# Altium schematic sheet Sheet1.SchDoc
size A4
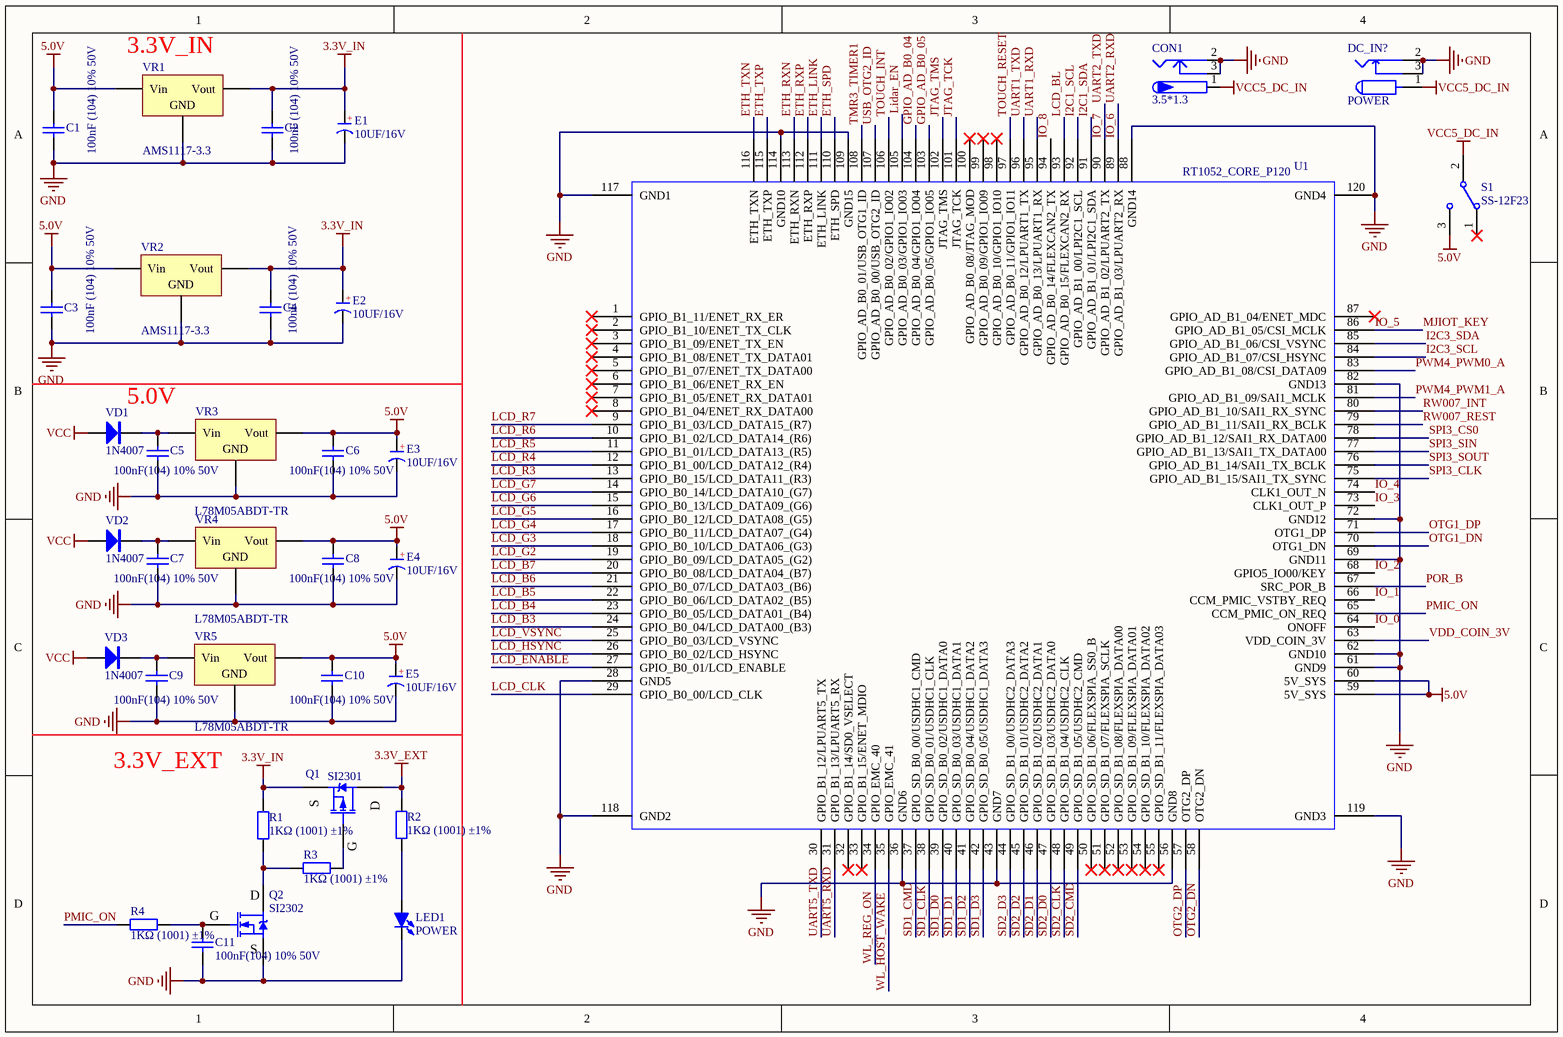
[diagram p0: Sheet1.SchDoc]

## Parts
C1  100nF (104) 10% 50V  [0603_C]
C2  100nF (104) 10% 50V  [0603_C]
C3  100nF (104) 10% 50V  [0603_C]
C4  100nF (104) 10% 50V  [0603_C]
C5  100nF(104) 10% 50V  [0805_C]
C6  100nF(104) 10% 50V  [0805_C]
C7  100nF(104) 10% 50V  [0805_C]
C8  100nF(104) 10% 50V  [0805_C]
C9  100nF(104) 10% 50V  [0805_C]
C10  100nF(104) 10% 50V  [0805_C]
C11  100nF(104) 10% 50V  [0805_C]
CON1  3.5*1.3  [DC-005]
DC_IN?  POWER  [DC10B]
E1  10UF/16V  [CAP 1.5*4*8]
E2  10UF/16V  [CAP 1.5*4*8]
E3  10UF/16V  [CAP 1.5*4*8 - GD]
E4  10UF/16V  [CAP 1.5*4*8 - GD]
E5  10UF/16V  [CAP 1.5*4*8 - GD]
LED1  POWER  [LED 3MM-B]
Q1  SI2301  [SOT23-3N]
Q2  SI2302  [SOT23-3N]
R1  1KΩ (1001) ±1%  [0603_R]
R2  1KΩ (1001) ±1%  [0603_R]
R3  1KΩ (1001) ±1%  [0603_R]
R4  1KΩ (1001) ±1%  [0603_R]
S1  SS-12F23  [SS-12F23]
U1  RT1052_CORE_P120  [RT1052_CORE_P120]
VD1  1N4007  [DO-41]
VD2  1N4007  [DO-41]
VD3  1N4007  [DO-41]
VR1  AMS1117-3.3  [SOT-223]
VR2  AMS1117-3.3  [SOT-223]
VR3  L78M05ABDT-TR  [TO-252-2-180]
VR4  L78M05ABDT-TR  [TO-252-2-180]
VR5  L78M05ABDT-TR  [TO-252-2-180]

## Nets
3.3V_EXT: Q1.3(D) R2.2
3.3V_IN: C2.2 C4.2 E1.1(A) E2.1(A) Q1.2(S) R1.2 VR1.2(Vout) VR2.2(Vout)
5.0V: C1.2 C3.2 C6.1 C8.1 C10.1 E3.1(A) E4.1(A) E5.1(A) S1.3 U1.59(5V_SYS) U1.60(5V_SYS) VR1.3(Vin) VR2.3(Vin) VR3.3(Vout) VR4.3(Vout) VR5.3(Vout)
GND: C1.1 C2.1 C3.1 C4.1 C5.2 C6.2 C7.2 C8.2 C9.2 C10.2 C11.2 CON1.2 CON1.3 DC_IN?.2 DC_IN?.3 E1.2(K) E2.2(K) E3.2(K) E4.2(K) E5.2(K) LED1.2(K) Q2.2(S) U1.28(GND5) U1.36(GND6) U1.43(GND7) U1.56(GND8) U1.61(GND9) U1.62(GND10) U1.69(GND11) U1.72(GND12) U1.82(GND13) U1.88(GND14) U1.109(GND15) U1.114(GND10) U1.117(GND1) U1.118(GND2) U1.119(GND3) U1.120(GND4) VR1.1(GND) VR2.1(GND) VR3.2(GND) VR4.2(GND) VR5.2(GND)
VCC: VD1.1(A) VD2.1(A) VD3.1(A)
VCC5_DC_IN: CON1.1 DC_IN?.1 S1.2
ETH_LINK: U1.111(ETH_LINK)
ETH_RXN: U1.113(ETH_RXN)
ETH_RXP: U1.112(ETH_RXP)
ETH_SPD: U1.110(ETH_SPD)
ETH_TXN: U1.116(ETH_TXN)
ETH_TXP: U1.115(ETH_TXP)
GPIO_AD_B0_04: U1.104(GPIO_AD_B0_04/GPIO1_IO04)
GPIO_AD_B0_05: U1.103(GPIO_AD_B0_05/GPIO1_IO05)
I2C1_SCL: U1.92(GPIO_AD_B1_00/LPI2C1_SCL)
I2C1_SDA: U1.91(GPIO_AD_B1_01/LPI2C1_SDA)
I2C3_SCL: U1.84(GPIO_AD_B1_07/CSI_HSYNC)
I2C3_SDA: U1.85(GPIO_AD_B1_06/CSI_VSYNC)
IO_0: U1.64(ONOFF)
IO_1: U1.66(CCM_PMIC_VSTBY_REQ)
IO_2: U1.68(GPIO5_IO00/KEY)
IO_3: U1.73(CLK1_OUT_P)
IO_4: U1.74(CLK1_OUT_N)
IO_5: U1.86(GPIO_AD_B1_05/CSI_MCLK)  [also labelled MJIOT_KEY]
IO_6: U1.89(GPIO_AD_B1_03/LPUART2_RX)  [also labelled UART2_RXD]
IO_7: U1.90(GPIO_AD_B1_02/LPUART2_TX)  [also labelled UART2_TXD]
IO_8: U1.94(GPIO_AD_B0_14/FLEXCAN2_TX)
JTAG_TCK: U1.101(JTAG_TCK)
JTAG_TMS: U1.102(JTAG_TMS)
LCD_B3: U1.24(GPIO_B0_04/LCD_DATA00_(B3))
LCD_B4: U1.23(GPIO_B0_05/LCD_DATA01_(B4))
LCD_B5: U1.22(GPIO_B0_06/LCD_DATA02_(B5))
LCD_B6: U1.21(GPIO_B0_07/LCD_DATA03_(B6))
LCD_B7: U1.20(GPIO_B0_08/LCD_DATA04_(B7))
LCD_BL: U1.93(GPIO_AD_B0_15/FLEXCAN2_RX)
LCD_CLK: U1.29(GPIO_B0_00/LCD_CLK)
LCD_ENABLE: U1.27(GPIO_B0_01/LCD_ENABLE)
LCD_G2: U1.19(GPIO_B0_09/LCD_DATA05_(G2))
LCD_G3: U1.18(GPIO_B0_10/LCD_DATA06_(G3))
LCD_G4: U1.17(GPIO_B0_11/LCD_DATA07_(G4))
LCD_G5: U1.16(GPIO_B0_12/LCD_DATA08_(G5))
LCD_G6: U1.15(GPIO_B0_13/LCD_DATA09_(G6))
LCD_G7: U1.14(GPIO_B0_14/LCD_DATA10_(G7))
LCD_HSYNC: U1.26(GPIO_B0_02/LCD_HSYNC)
LCD_R3: U1.13(GPIO_B0_15/LCD_DATA11_(R3))
LCD_R4: U1.12(GPIO_B1_00/LCD_DATA12_(R4))
LCD_R5: U1.11(GPIO_B1_01/LCD_DATA13_(R5))
LCD_R6: U1.10(GPIO_B1_02/LCD_DATA14_(R6))
LCD_R7: U1.9(GPIO_B1_03/LCD_DATA15_(R7))
LCD_VSYNC: U1.25(GPIO_B0_03/LCD_VSYNC)
Lidar_EN: U1.105(GPIO_AD_B0_03/GPIO1_IO03)
OTG1_DN: U1.70(OTG1_DN)
OTG1_DP: U1.71(OTG1_DP)
OTG2_DN: U1.58(OTG2_DN)
OTG2_DP: U1.57(OTG2_DP)
PMIC_ON: R4.2 U1.65(CCM_PMIC_ON_REQ)
POR_B: U1.67(SRC_POR_B)
PWM4_PWM0_A: U1.83(GPIO_AD_B1_08/CSI_DATA09)
PWM4_PWM1_A: U1.81(GPIO_AD_B1_09/SAI1_MCLK)
RW007_INT: U1.80(GPIO_AD_B1_10/SAI1_RX_SYNC)
RW007_REST: U1.79(GPIO_AD_B1_11/SAI1_RX_BCLK)
SD1_CLK: U1.38(GPIO_SD_B0_01/USDHC1_CLK)
SD1_CMD: U1.37(GPIO_SD_B0_00/USDHC1_CMD)
SD1_D0: U1.39(GPIO_SD_B0_02/USDHC1_DATA0)
SD1_D1: U1.40(GPIO_SD_B0_03/USDHC1_DATA1)
SD1_D2: U1.41(GPIO_SD_B0_04/USDHC1_DATA2)
SD1_D3: U1.42(GPIO_SD_B0_05/USDHC1_DATA3)
SD2_CLK: U1.48(GPIO_SD_B1_04/USDHC2_CLK)
SD2_CMD: U1.49(GPIO_SD_B1_05/USDHC2_CMD)
SD2_D0: U1.47(GPIO_SD_B1_03/USDHC2_DATA0)
SD2_D1: U1.46(GPIO_SD_B1_02/USDHC2_DATA1)
SD2_D2: U1.45(GPIO_SD_B1_01/USDHC2_DATA2)
SD2_D3: U1.44(GPIO_SD_B1_00/USDHC2_DATA3)
SPI3_CLK: U1.75(GPIO_AD_B1_15/SAI1_TX_SYNC)
SPI3_CS0: U1.78(GPIO_AD_B1_12/SAI1_RX_DATA00)
SPI3_SIN: U1.77(GPIO_AD_B1_13/SAI1_TX_DATA00)
SPI3_SOUT: U1.76(GPIO_AD_B1_14/SAI1_TX_BCLK)
TMR3_TIMER1: U1.108(GPIO_AD_B0_01/USB_OTG1_ID)
TOUCH_INT: U1.106(GPIO_AD_B0_02/GPIO1_IO02)
TOUCH_RESET: U1.97(GPIO_AD_B0_11/GPIO1_IO11)
UART1_RXD: U1.95(GPIO_AD_B0_13/LPUART1_RX)
UART1_TXD: U1.96(GPIO_AD_B0_12/LPUART1_TX)
UART5_RXD: U1.31(GPIO_B1_13/LPUART5_RX)
UART5_TXD: U1.30(GPIO_B1_12/LPUART5_TX)
USB_OTG2_ID: U1.107(GPIO_AD_B0_00/USB_OTG2_ID)
VDD_COIN_3V: U1.63(VDD_COIN_3V)
WL_HOST_WAKE: U1.35(GPIO_EMC_41)
WL_REG_ON: U1.34(GPIO_EMC_40)
NetC5_1: C5.1 VD1.2(K) VR3.1(Vin)
NetC7_1: C7.1 VD2.2(K) VR4.1(Vin)
NetC9_1: C9.1 VD3.2(K) VR5.1(Vin)
NetC11_1: C11.1 Q2.1(G) R4.1
NetLED1_1: LED1.1(A) R2.1
NetQ1_1: Q1.1(G) R3.1
NetQ2_3: Q2.3(D) R1.1 R3.2

Not connected (* = marked no-connect by the designer): S1 1*; U1 1(GPIO_B1_11/ENET_RX_ER)* 2(GPIO_B1_10/ENET_TX_CLK)* 3(GPIO_B1_09/ENET_TX_EN)* 4(GPIO_B1_08/ENET_TX_DATA01)* 5(GPIO_B1_07/ENET_TX_DATA00)* 6(GPIO_B1_06/ENET_RX_EN)* 7(GPIO_B1_05/ENET_RX_DATA01)* 8(GPIO_B1_04/ENET_RX_DATA00)* 32(GPIO_B1_14/SD0_VSELECT)* 33(GPIO_B1_15/ENET_MDIO)* 50(GPIO_SD_B1_06/FLEXSPIA_SS0_B)* 51(GPIO_SD_B1_07/FLEXSPIA_SCLK)* 52(GPIO_SD_B1_08/FLEXSPIA_DATA00)* 53(GPIO_SD_B1_09/FLEXSPIA_DATA01)* 54(GPIO_SD_B1_10/FLEXSPIA_DATA02)* 55(GPIO_SD_B1_11/FLEXSPIA_DATA03)* 87(GPIO_AD_B1_04/ENET_MDC)* 98(GPIO_AD_B0_10/GPIO1_IO10)* 99(GPIO_AD_B0_09/GPIO1_IO09)* 100(GPIO_AD_B0_08/JTAG_MOD)*

## Notes on the sheet
- (near VR1) 3.3V_IN
- 5.0V
- 3.3V_EXT
- Title
- Size:
- Date:
- A4
- Number:
- Time:
- Revision:
- Sheet
- of
- File:
- (in symbol C-CAP) +

## Library data of the parts
C1-C4 = 0603 100nF (104) 10% 50V: 贴片电容; ComponentLink1Description: 供应商链接; ComponentLink1URL: http://www.szlcsc.com/product/details_15331.html; Package: 0603; Supplier: LC; SuppliersPartNumber: C14663
C5-C11 = 0805 100nF(104) 10% 50V: 贴片电容; ComponentLink1Description: 供应商链接; ComponentLink1URL: http://www.szlcsc.com/product/details_50686.html; Package: 0805; Supplier: LC; SuppliersPartNumber: C49678
CON1 = P-DC: 低压电源接口; BOM名称: DC电源接口; 版权归属: 源创客; 学习资源: www.ooocke.com
DC_IN? = POW
E1-E5 = C-CAP: 直插电解电容; 版权归属: 源创客; BOM名称: 直插电解电容; 学习资源: www.ooocke.com
LED1 = LED-3MM: 插件LED; 版权归属: 源创客; BOM名称: 插件LED; 学习资源: www.ooocke.com
Q1 = SI2301: P沟道场效应管; 版权归属: 源创客; BOM名称: P沟道场效应管; 学习资源: www.ooocke.com
Q2 = SI2302: N沟道场效应管; 版权归属: 源创客; BOM名称: N沟道场效应管; 学习资源: www.ooocke.com
R1-R4 = 0603 1KΩ (1001) 1%: 贴片电阻; ComponentLink1Description: 供应商链接; ComponentLink1URL: http://www.szlcsc.com/product/details_21904.html; Package: 0603; Supplier: LC; SuppliersPartNumber: C21190
S1 = SSW-1P: 1路波动开关; BOM名称: 波动开关; 版权归属: 源创客; 学习资源: www.ooocke.com
VD1-VD3 = 1N4007: 整流二极管; 版权归属: 源创客; BOM名称: 整流二极管; 学习资源: www.ooocke.com
VR1 VR2 = SOT-223 AMS1117-3.3: 低压差线性稳压(LDO); ComponentLink1Description: 供应商链接; ComponentLink1URL: http://www.szlcsc.com/product/details_6652.html; Package: SOT-223; Supplier: LC; SuppliersPartNumber: C6186
VR3-VR5 = TO-252-2 L78M05ABDT-TR: 低压差线性稳压(LDO); ComponentLink1Description: 供应商链接; ComponentLink1URL: http://www.szlcsc.com/product/details_59107.html; Package: TO-252-2; Supplier: LC; SuppliersPartNumber: C58069
U1 = RT1052_CORE_P120: PCB DECAL: *; Source_Path: *; Value: *